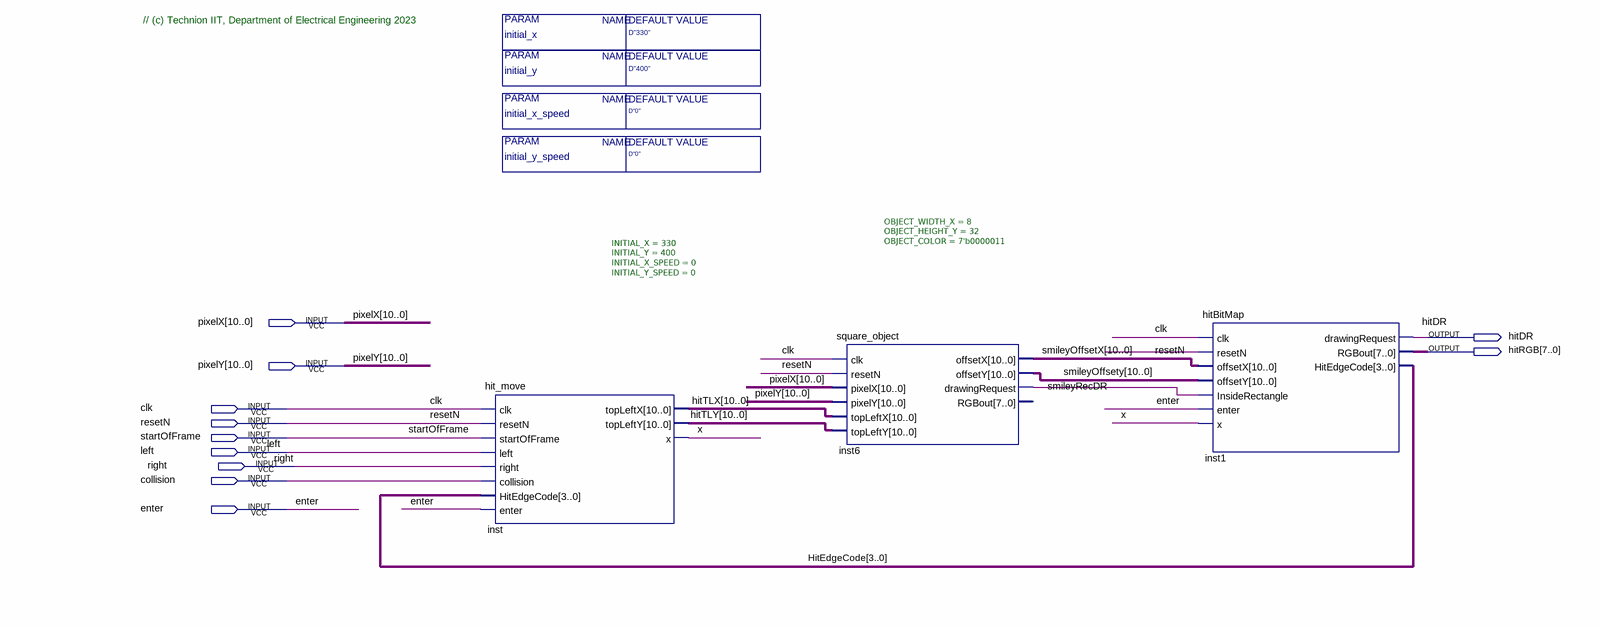
[diagram p0: schematic sheet]
// Quartus schematic Hit_Block_T.bdf as structural Verilog: 3 symbols, 11 pins
module Hit_Block_T #(parameter initial_y = "D\"400\"", parameter initial_x_speed = "D\"0\"", parameter initial_y_speed = "D\"0\"", parameter initial_x = "D\"330\"") (
  input  [10:0] pixelX,
  input  [10:0] pixelY,
  input  clk,
  input  resetN,
  input  startOfFrame,
  input  left,
  input  right,
  input  collision,
  input  enter,
  output hitDR,
  output [7:0] hitRGB
);

  wire smileyRecDR, x;
  wire [3:0] HitEdgeCode;
  wire [10:0] hitTLX, hitTLY, smileyOffsetX, smileyOffsety;

  hit_move #(.INITIAL_X(330), .INITIAL_Y(400), .INITIAL_X_SPEED(0), .INITIAL_Y_SPEED(0)) inst (
    .clk(clk), .resetN(resetN), .startOfFrame(startOfFrame), .left(left), .right(right),
    .collision(collision), .HitEdgeCode(HitEdgeCode), .enter(enter), .topLeftX(hitTLX), .topLeftY(hitTLY),
    .x(x));
  square_object #(.OBJECT_WIDTH_X(8), .OBJECT_HEIGHT_Y(32), .OBJECT_COLOR(7'b0000011)) inst6 (
    .clk(clk), .resetN(resetN), .pixelX(pixelX), .pixelY(pixelY), .topLeftX(hitTLX), .topLeftY(hitTLY),
    .offsetX(smileyOffsetX), .offsetY(smileyOffsety), .drawingRequest(smileyRecDR));  // open: RGBout
  hitBitMap inst1 (
    .clk(clk), .resetN(resetN), .offsetX(smileyOffsetX), .offsetY(smileyOffsety),
    .InsideRectangle(smileyRecDR), .enter(enter), .x(x), .drawingRequest(hitDR), .RGBout(hitRGB),
    .HitEdgeCode(HitEdgeCode));

  // Notes on the sheet:
  //   // (c) Technion IIT, Department of Electrical Engineering 2023
endmodule
